# EAGLE design OutSideHouse (EAGLE 7.5.0)
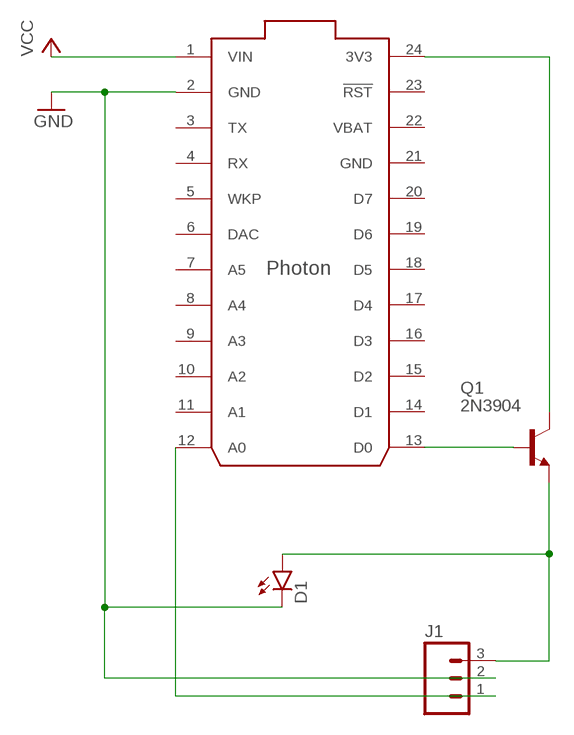
[diagram p0: schematic, sheet 1]

## Parts
D1  LED5MM  [LED5MM]
J1  M03LONGPADS  [1X03_LONGPADS]
Q1  2N3904  [TO92]
U$1  PHOTON_WITH_HEADERS  [PHOTON]

## Nets
GND: D1.K(C) J1.2 U$1.2(GND)
N$1: Q1.1(C) U$1.24(3V3)
N$2: Q1.2(B) U$1.13(D0)
N$3: D1.A J1.3 Q1.3(E)
N$4: J1.1 U$1.12(A0)
VCC: U$1.1(VIN)
Unconnected: U$1.3(TX) U$1.4(RX) U$1.5(WKP) U$1.6(DAC) U$1.7(A5) U$1.8(A4) U$1.9(A3) U$1.10(A2) U$1.11(A1) U$1.14(D1) U$1.15(D2) U$1.16(D3) U$1.17(D4) U$1.18(D5) U$1.19(D6) U$1.20(D7) U$1.23(!RST)

## Power pins joined to a net without a drawn wire
GND: U$1.21(GND)
VBAT: U$1.22(VBAT)

## Library data of the parts
D1 = SparkFun-LED:LED: LEDs Standard schematic elements and footprints for 5mm, 3mm, 1206, and 0603 sized LEDs. 5mm - Spark Fun Electronics SKU : COM-00529 (and others)
J1 = SparkFun-Connectors:M03: Header 3 Standard 3-pin 0.1" header. Use with straight break away headers (SKU : PRT-00116), right angle break away headers (PRT-00553), swiss pins (PRT-00743), machine pins (PRT-00117), and female headers (PRT-00115). Molex polarized connector foot print use with SKU : PRT-08232 with associated crimp pins and housings.
Q1 = transistor-npn:2N3904: NPN Transistor
U$1 = Spark:PHOTON

## Board
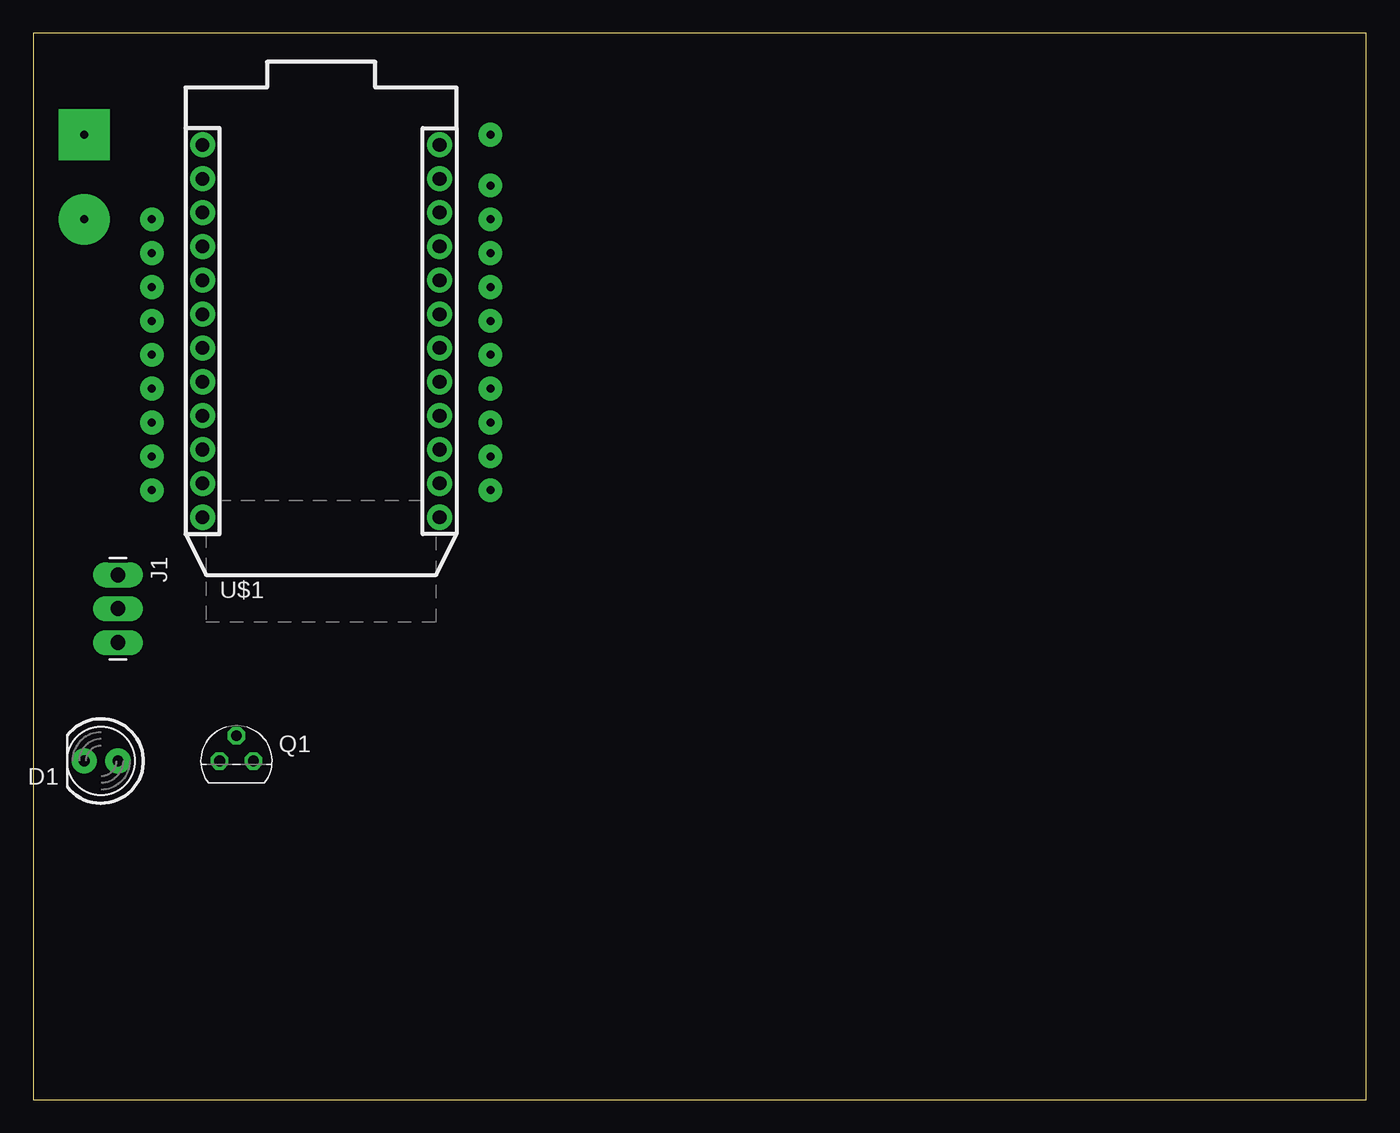
[diagram p1: board, top side]
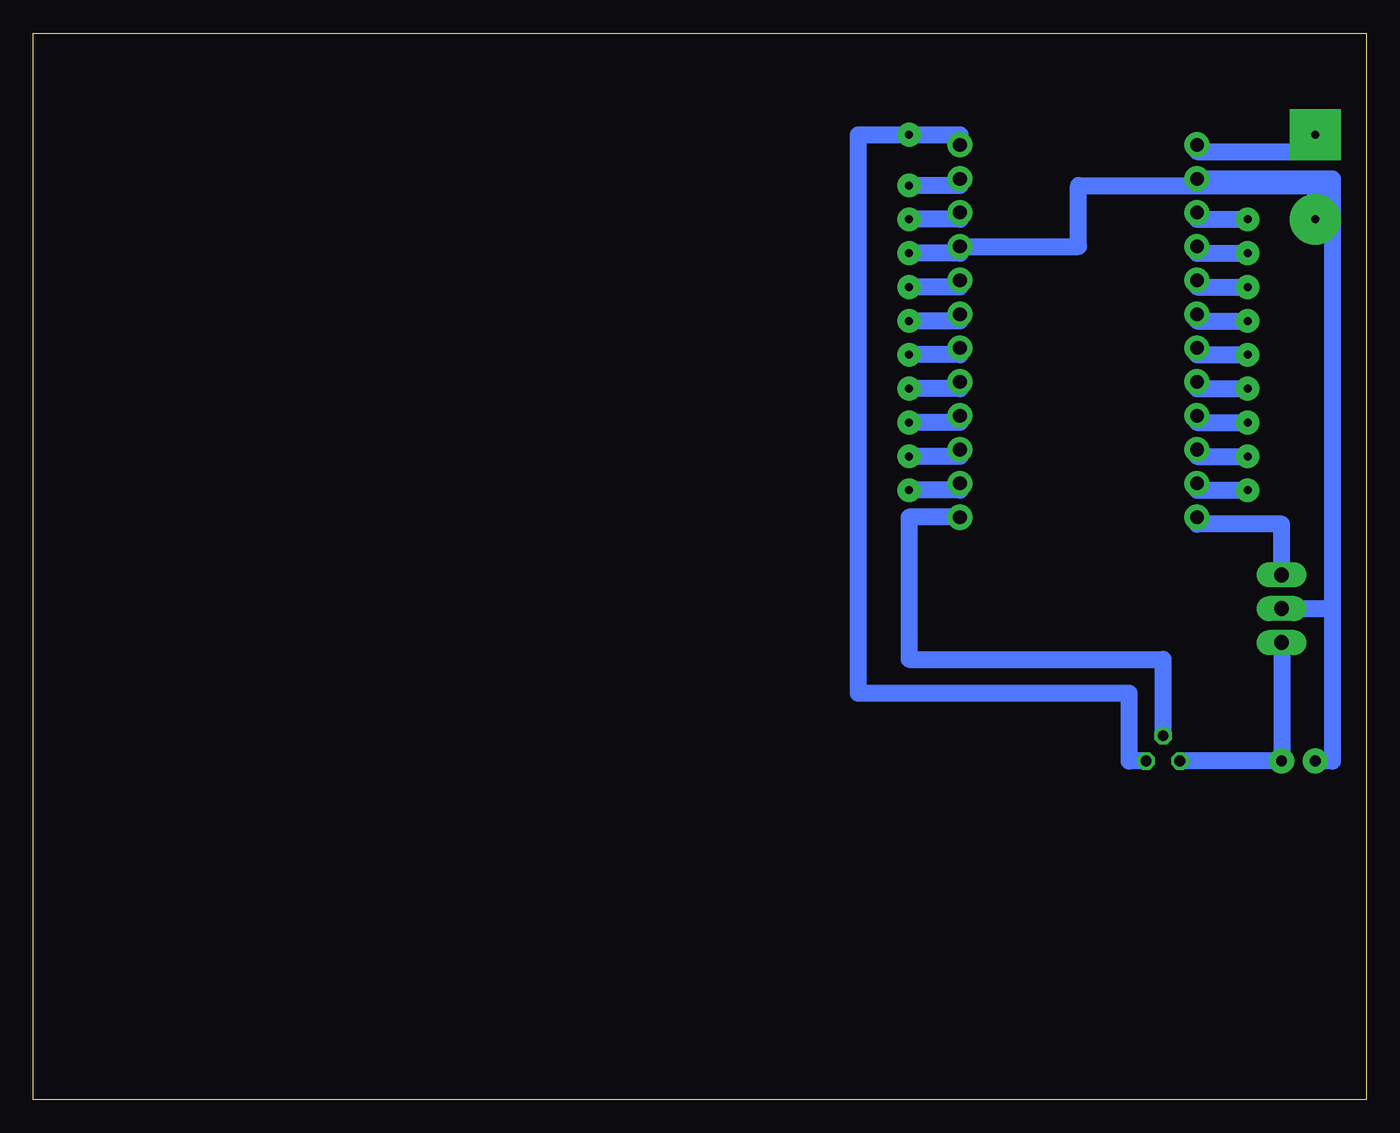
[diagram p2: board, bottom side, seen from below]

Size 100 x 80 mm. Coordinates in mm from the lower left corner, seen from the top.
Outline: 0,0 100,0 100,80 0,80 0,0
Copper layers (1*16): Top 0.035mm / dielectric 1.5mm / Bottom 0.035mm
Design rules "default": minimum track width 10mil, minimum drill 24mil, track to track 8mil, track to pad 8mil, pad to pad 8mil, via to via 8mil, smd to smd 8mil, copper to edge 40mil, drill to drill 8mil, minimum pad ring 10mil, minimum via ring 8mil, stop-mask expansion 4mil, vias tented up to drill 0mil, thermal gap 10mil

### Footprints (pad centres in the part's own frame; a part is rotated, then mirrored left to right if it is on the bottom)
LED5MM = drill 0.813 pad 1.88: A -1.27,0; K 1.27,0
1X03_LONGPADS = drill 1.118 pad 1.88 long: 1 0,0; 2 2.54,0; 3 5.08,0
TO92 = drill 0.813 octagon: 1 1.27,0; 2 0,1.905; 3 -1.27,0
PHOTON = drill 1.016 pad 1.88: 1 1.27,32.258; 2 1.27,29.718; 3 1.27,27.178; 4 1.27,24.638; 5 1.27,22.098; 6 1.27,19.558; 7 1.27,17.018; 8 1.27,14.478; 9 1.27,11.938; 10 1.27,9.398; 11 1.27,6.858; 12 1.27,4.318; 13 19.05,4.318; 14 19.05,6.858; 15 19.05,9.398; 16 19.05,11.938; 17 19.05,14.478; 18 19.05,17.018; 19 19.05,19.558; 20 19.05,22.098; 21 19.05,24.638; 22 19.05,27.178; 23 19.05,29.718; 24 19.05,32.258

### Placement (x,y rotation side)
D1  5.08,25.4 180 top
J1  6.35,39.37 270 top
Q1  15.24,25.4 0 top
U$1  11.43,39.37 0 top

### Tracks (layer width: path | path; a pad name or v marks a point on that pad's centre or on a via)
GND
  Bottom 1.27: 2.54,36.83 2.54,69.09 U$1.2 12.7,68.58 21.59,68.58 21.59,64.01 U$1.21 | J1.2 2.54,36.83 | 2.54,36.83 2.54,25.4 D1.K
N$1
  Bottom 1.27: Q1.1 17.78,25.4 17.78,30.48 38.1,30.48 38.1,72.39 30.48,72.39 U$1.24
N$2
  Bottom 1.27: U$1.13 34.29,43.69 34.29,33.02 15.24,33.02 Q1.2
N$3
  Bottom 1.27: J1.3 D1.A Q1.3
N$4
  Bottom 1.27: J1.1 6.35,43.18 12.7,43.18 U$1.12
N$5  (via drill 0.6 pad 3.81)
  Bottom 1.27: 12.7,71.12 3.81,71.12 v3.81,72.39
N$6  (via drill 0.6 pad 3.81)
  Bottom 1.27: 12.7,68.58 3.81,68.58 v3.81,66.04
N$7  (via drill 0.6 pad 1.78)
  Bottom 1.27: 30.48,45.72 v34.29,45.72
N$8  (via drill 0.6 pad 1.78)
  Bottom 1.27: 30.48,48.26 v34.29,48.26
N$9  (via drill 0.6 pad 1.78)
  Bottom 1.27: 30.48,50.8 v34.29,50.8
N$10  (via drill 0.6 pad 1.78)
  Bottom 1.27: 30.48,53.34 v34.29,53.34
N$11  (via drill 0.6 pad 1.78)
  Bottom 1.27: 30.48,55.88 v34.29,55.88
N$12  (via drill 0.6 pad 1.78)
  Bottom 1.27: 30.48,58.42 v34.29,58.42
N$13  (via drill 0.6 pad 1.78)
  Bottom 1.27: 30.48,60.96 v34.29,60.96
N$14  (via drill 0.6 pad 1.78)
  Bottom 1.27: 30.48,63.5 v34.29,63.5
N$15  (via drill 0.6 pad 1.78)
  Bottom 1.27: 30.48,66.04 v34.29,66.04
N$16  (via drill 0.6 pad 1.78)
  Bottom 1.27: 30.48,68.58 v34.29,68.58
N$17  (via drill 0.6 pad 1.78)
  other vias: 34.29,72.39
N$18  (via drill 0.6 pad 1.78)
  Bottom 1.27: 12.7,66.04 v8.89,66.04
N$19  (via drill 0.6 pad 1.78)
  Bottom 1.27: 12.7,63.5 v8.89,63.5
N$20  (via drill 0.6 pad 1.78)
  Bottom 1.27: 12.7,60.96 v8.89,60.96
N$21  (via drill 0.6 pad 1.78)
  Bottom 1.27: 12.7,58.42 v8.89,58.42
N$22  (via drill 0.6 pad 1.78)
  Bottom 1.27: 12.7,55.88 v8.89,55.88
N$23  (via drill 0.6 pad 1.78)
  Bottom 1.27: 12.7,53.34 v8.89,53.34
N$24  (via drill 0.6 pad 1.78)
  Bottom 1.27: 12.7,50.8 v8.89,50.8
N$25  (via drill 0.6 pad 1.78)
  Bottom 1.27: 12.7,48.26 v8.89,48.26
N$26  (via drill 0.6 pad 1.78)
  Bottom 1.27: 12.7,45.72 v8.89,45.72